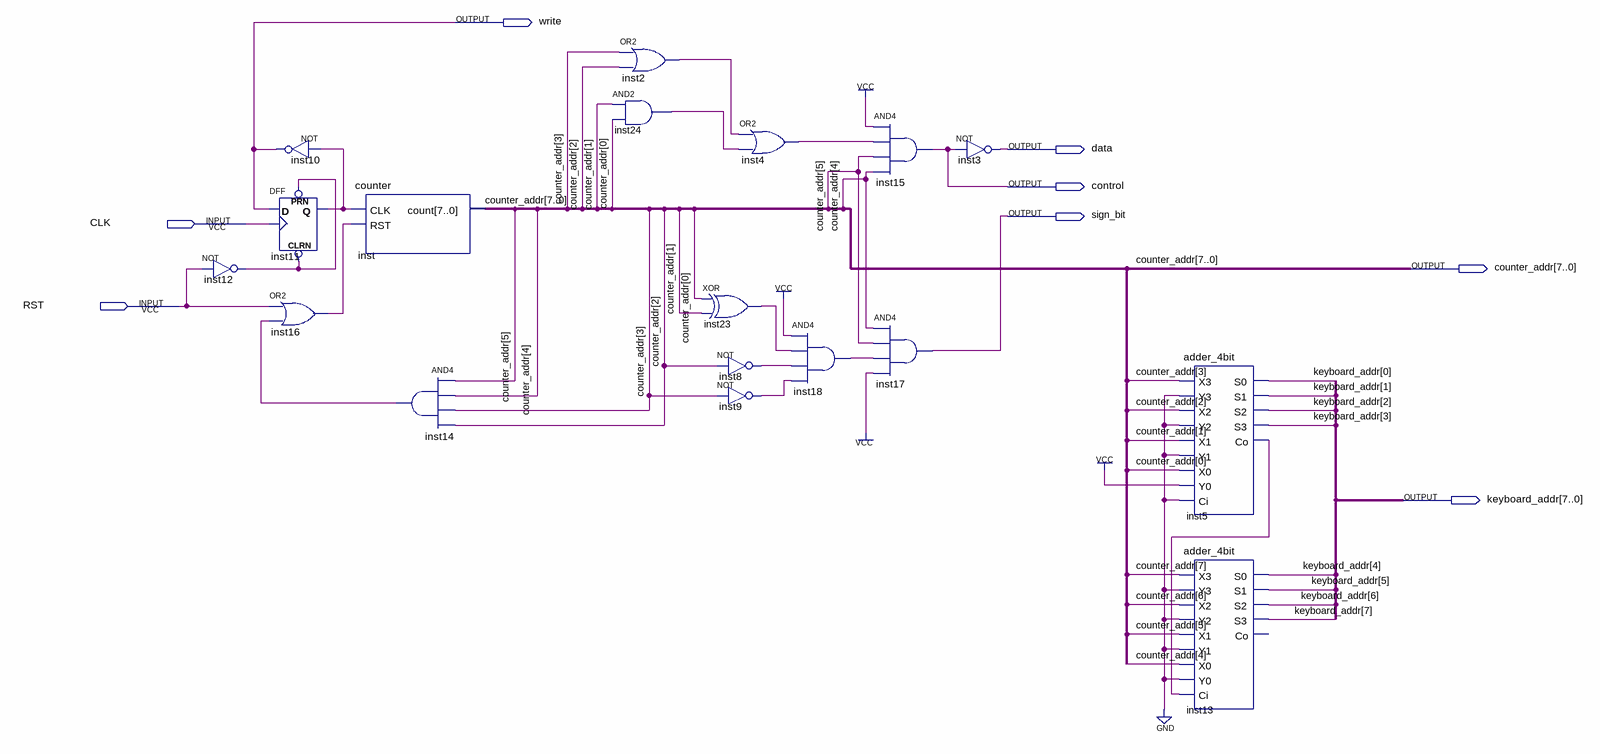
[diagram p0: schematic sheet]
// Quartus schematic timing_module.bdf as structural Verilog: 18 symbols, 8 pins
module timing_module (
  input  CLK,
  input  RST,
  output write,
  output data,
  output control,
  output sign_bit,
  output [7:0] counter_addr,
  output [7:0] keyboard_addr
);

  wire inst2_out, inst4_out, inst5_co, inst8_out, inst9_out, inst11_q, inst12_out, inst14_out, inst16_out,
       inst18_out, inst23_out, inst24_out;

  not inst12 (inst12_out, RST);
  not inst10 (write, inst11_q);
  DFF inst11 (.CLRN(inst12_out), .CLK(CLK), .D(write), .PRN(inst12_out), .Q(inst11_q));
  or inst16 (inst16_out, RST, inst14_out);
  counter inst (.CLK(inst11_q), .RST(inst16_out), .count(counter_addr));
  and inst14 (inst14_out, counter_addr[5], counter_addr[4], counter_addr[3], counter_addr[2]);
  or inst2 (inst2_out, counter_addr[3], counter_addr[2]);
  and inst24 (inst24_out, counter_addr[1], counter_addr[0]);
  xor inst23 (inst23_out, counter_addr[0], counter_addr[1]);
  not inst8 (inst8_out, counter_addr[2]);
  not inst9 (inst9_out, counter_addr[3]);
  or inst4 (inst4_out, inst2_out, inst24_out);
  and inst18 (inst18_out, 1'b1, inst23_out, inst8_out, inst9_out);
  and inst15 (control, 1'b1, inst4_out, counter_addr[5], counter_addr[4]);
  and inst17 (sign_bit, counter_addr[4], counter_addr[5], inst18_out, 1'b1);
  not inst3 (data, control);
  adder_4bit inst5 (
    .X3(counter_addr[3]), .Y3(1'b0), .X2(counter_addr[2]), .Y2(1'b0), .X1(counter_addr[1]), .Y1(1'b0),
    .X0(counter_addr[0]), .Y0(1'b1), .Ci(1'b0), .S0(keyboard_addr[0]), .S1(keyboard_addr[1]),
    .S2(keyboard_addr[2]), .S3(keyboard_addr[3]), .Co(inst5_co));
  adder_4bit inst13 (
    .X3(counter_addr[7]), .Y3(1'b0), .X2(counter_addr[6]), .Y2(1'b0), .X1(counter_addr[5]), .Y1(1'b0),
    .X0(counter_addr[4]), .Y0(1'b0), .Ci(inst5_co), .S0(keyboard_addr[4]), .S1(keyboard_addr[5]),
    .S2(keyboard_addr[6]), .S3(keyboard_addr[7]));  // open: Co
endmodule
